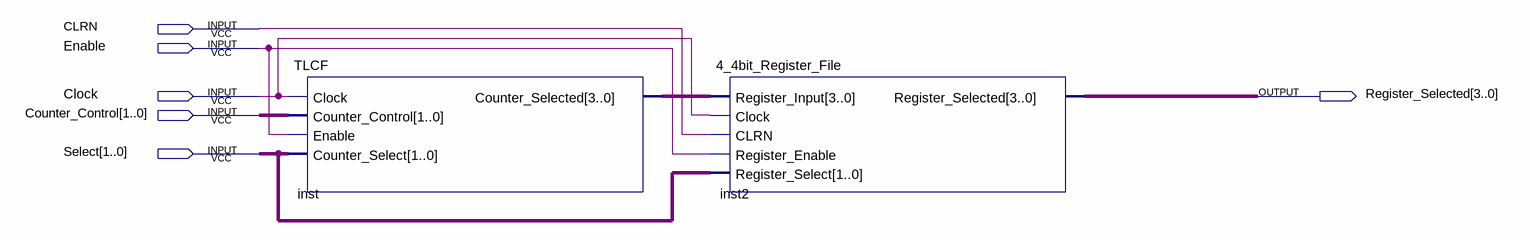
[diagram p0: schematic sheet]
// Quartus schematic RCC.bdf as structural Verilog: 2 symbols, 6 pins
module RCC (
  input  CLRN,
  input  Enable,
  input  Clock,
  input  [1:0] Counter_Control,
  input  [1:0] Select,
  output [3:0] Register_Selected
);

  wire [3:0] inst_counter_selected;

  TLCF inst (
    .Clock(Clock), .Counter_Control(Counter_Control), .Enable(Enable), .Counter_Select(Select),
    .Counter_Selected(inst_counter_selected));
  \4_4bit_Register_File  inst2 (
    .Register_Input(inst_counter_selected), .Clock(Clock), .CLRN(CLRN), .Register_Enable(Enable),
    .Register_Select(Select), .Register_Selected(Register_Selected));
endmodule
